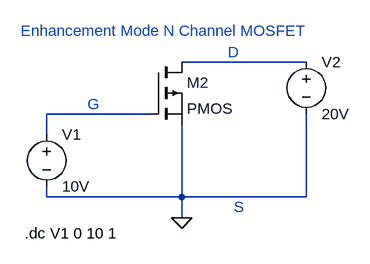
[diagram p0: schematic Draft2.asc]
Draft2.asc, the LTspice schematic file:
Version 4
SHEET 1 880 680
WIRE 528 128 336 128
WIRE 288 208 128 208
WIRE 128 240 128 208
WIRE 128 336 128 320
WIRE 336 336 336 224
WIRE 336 336 128 336
WIRE 528 336 528 208
WIRE 528 336 336 336
WIRE 336 368 336 336
FLAG 336 368 0
SYMBOL voltage 128 224 R0
WINDOW 123 0 0 Left 0
WINDOW 39 0 0 Left 0
SYMATTR InstName V1
SYMATTR Value 10V
SYMBOL voltage 528 112 R0
WINDOW 123 0 0 Left 0
WINDOW 39 0 0 Left 0
SYMATTR InstName V2
SYMATTR Value 20V
SYMBOL pmos 288 128 R0
SYMATTR InstName M2
TEXT 94 392 Left 2 !.dc V1 0 10 1
TEXT 416 128 Bottom 2 ;D
TEXT 424 336 Top 2 ;S
TEXT 200 208 Bottom 2 ;G
TEXT 88 80 Left 2 ;Enhancement Mode N Channel MOSFET

The netlist it stands for:
* Draft2.asc
V1 N002 0 10V
V2 N001 0 20V
M2 N001 N002 0 0 PMOS
.model NMOS NMOS
.model PMOS PMOS
.lib standard.mos
.dc V1 0 10 1
* D
* S
* G
* Enhancement Mode N Channel MOSFET
.backanno
.end